# Altium schematic sheet 02. Block diagram.SchDoc
size A3
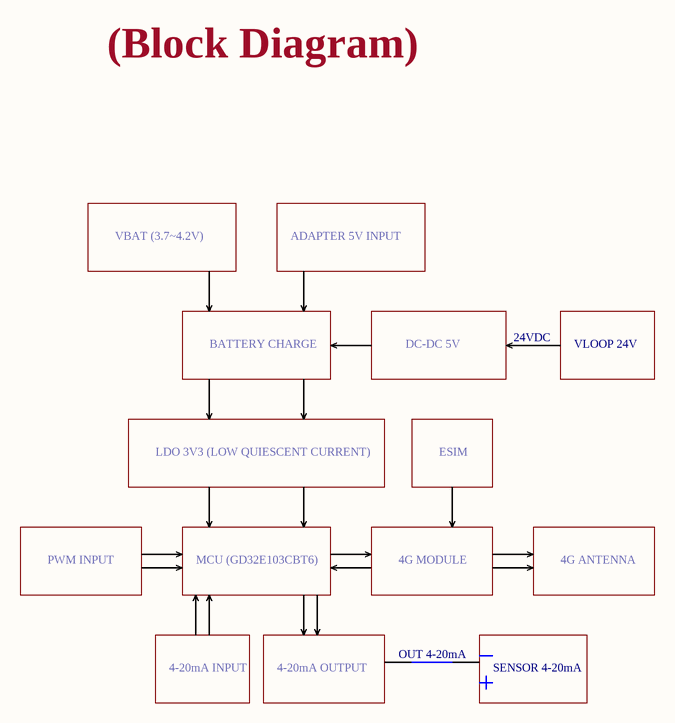
[diagram p0: 02. Block diagram.SchDoc]

## Notes on the sheet
- (Block Diagram)
- VBAT (3.7~4.2V)
- ADAPTER 5V INPUT
- BATTERY CHARGE
- DC-DC 5V
- 24VDC
- VLOOP 24V
- LDO 3V3 (LOW QUIESCENT CURRENT)
- ESIM
- PWM INPUT
- MCU (GD32E103CBT6)
- 4G MODULE
- 4G ANTENNA
- 4-20mA INPUT
- 4-20mA OUTPUT
- OUT 4-20mA
- SENSOR 4-20mA
- File:
- Project:
- REV:
- Size:
- A2
- Sheet:
- Drawn By:
- Checked By:
- DRAFT
- Approved By: